# EAGLE design 6moduleboard (EAGLE 6.5.0)
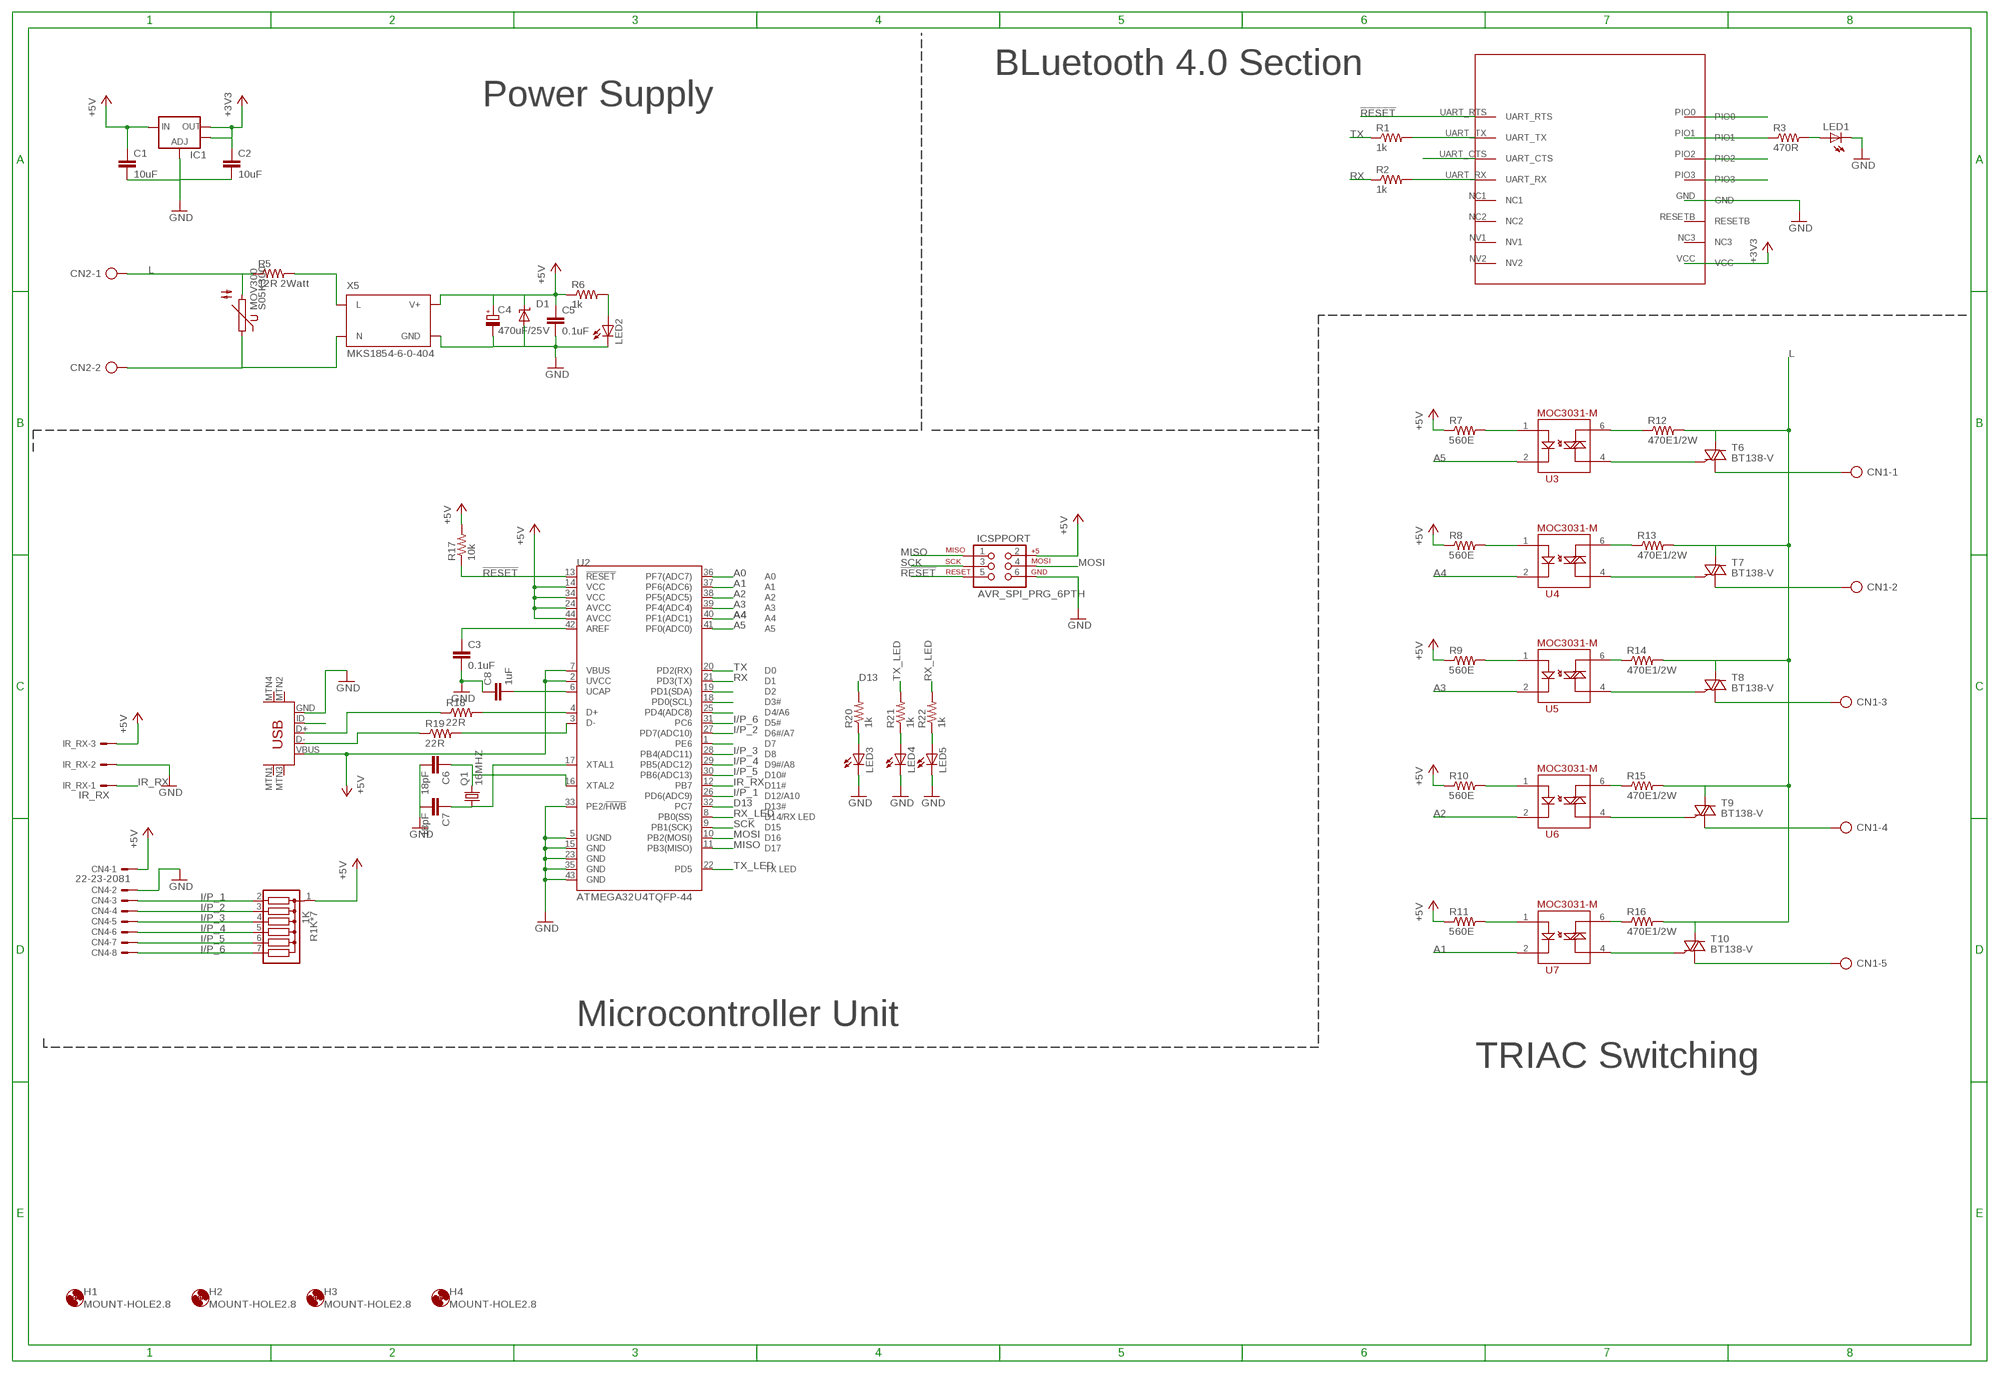
[diagram p0: schematic, sheet 1]

## Parts
C1  10uF  10UF-6.3V-20%(1206)  [1206]
C2  10uF  10UF-6.3V-20%(1206)  [1206]
C3  0.1uF  CAP1206  [1206]
C4  470uF/25V  CPOL-EUE5-8.5  [E5-8,5]
C5  0.1uF  1.0UF50V10%(1206)  [1206]
C6  18pF  CAP1206  [1206]
C7  18pF  CAP1206  [1206]
C8  1uF  CAP1206  [1206]
CN1  AK300/5  [AK300/5]
CN2  AK300/2  [AK300/2]
CN4  22-23-2081  [22-23-2081]
D1  SUPPRESSOR-SMBJ  [SMBJ]
H1  MOUNT-HOLE2.8  [2,8]
H2  MOUNT-HOLE2.8  [2,8]
H3  MOUNT-HOLE2.8  [2,8]
H4  MOUNT-HOLE2.8  [2,8]
IC1  V_REG_LM1117SOT223  [SOT223]
ICSPPORT  AVR_SPI_PRG_6PTH  [2X3]
IR_RX  IR_RX  22-23-2031  [22-23-2031]
LED1  LEDSMT1206  [1206]
LED2  LEDSMT1206  [1206]
LED3  LEDSMT1206  [1206]
LED4  LEDSMT1206  [1206]
LED5  LEDSMT1206  [1206]
MOV300  S05K300  [S05K300]
Q1  16MHZ  CRYSTALHC49UP  [HC49UP]
R1  1k  RESISTOR1206  [1206]
R1K*7  1K  G06R  [SIL7]
R2  1k  RESISTOR1206  [1206]
R3  470R  RESISTOR1206  [1206]
R5  12R 2Watt  R-US_0207/10  [0207/10]
R6  1k  RESISTOR1206  [1206]
R7  560E  RESISTOR1206  [1206]
R8  560E  RESISTOR1206  [1206]
R9  560E  RESISTOR1206  [1206]
R10  560E  RESISTOR1206  [1206]
R11  560E  RESISTOR1206  [1206]
R12  470E1/2W  R-US_0411/3V  [0411V]
R13  470E1/2W  R-US_0411/3V  [0411V]
R14  470E1/2W  R-US_0411/3V  [0411V]
R15  470E1/2W  R-US_0411/3V  [0411V]
R16  470E1/2W  R-US_0411/3V  [0411V]
R17  10k  RESISTOR1206  [1206]
R18  22R  RESISTOR1206  [1206]
R19  22R  RESISTOR1206  [1206]
R20  1k  RESISTOR1206  [1206]
R21  1k  RESISTOR1206  [1206]
R22  1k  RESISTOR1206  [1206]
T6  BT138-V  [TO220BV]
T7  BT138-V  [TO220BV]
T8  BT138-V  [TO220BV]
T9  BT138-V  [TO220BV]
T10  BT138-V  [TO220BV]
U2  ATMEGA32U4TQFP-44  [TQFP44]
U3  MOC3083  MOC3031-M  [DIL06]
U4  MOC3083  MOC3031-M  [DIL06]
U5  MOC3083  MOC3031-M  [DIL06]
U6  MOC3083  MOC3031-M  [DIL06]
U7  MOC3083  MOC3031-M  [DIL06]
U8  USB-MINIB-5PIN  [USB-MINIB]
U$1  HM-11  [HM-11]
X5  MKS1854-6-0-404  [MKS1854-6-0-404]

## Nets
!RESET: ICSPPORT.5 R17.1 U2.13(!RESET) U$1.UART_RTS
+3V3: C2.1 IC1.2(OUT) IC1.4(OUT) U$1.VCC
+5V: C1.1 C4.+ C5.1 CN4.1 D1.C IC1.3(IN) ICSPPORT.2 IR_RX.3 R1K*7.1 R6.1 R7.1 R8.1 R9.1 R10.1 R11.1 R17.2 U2.2(UVCC) U2.7(VBUS) U2.14(VCC) U2.24(AVCC) U2.34(VCC) U2.44(AVCC) U8.VBUS X5.3(V+)
A0: U2.36(PF7(ADC7))
A1: U2.37(PF6(ADC6)) U7.2
A2: U2.38(PF5(ADC5)) U6.2
A3: U2.39(PF4(ADC4)) U5.2
A4: U2.40(PF1(ADC1)) U4.2
A5: U2.41(PF0(ADC0)) U3.2
D13: R20.2 U2.32(PC7)
GND: C1.2 C2.2 C3.2 C4.- C5.2 C6.2 C7.2 C8.1 CN4.2 D1.A IC1.1(ADJ) ICSPPORT.6 IR_RX.2 LED1.C LED2.C LED3.C LED4.C LED5.C U2.5(UGND) U2.15(GND) U2.23(GND) U2.33(PE2/!HWB) U2.35(GND) U2.43(GND) U8.GND U$1.GND X5.4(GND)
I/P_1: CN4.3 R1K*7.2 U2.26(PD6(ADC9))
I/P_2: CN4.4 R1K*7.3 U2.27(PD7(ADC10))
I/P_3: CN4.5 R1K*7.4 U2.28(PB4(ADC11))
I/P_4: CN4.6 R1K*7.5 U2.29(PB5(ADC12))
I/P_5: CN4.7 R1K*7.6 U2.30(PB6(ADC13))
I/P_6: CN4.8 R1K*7.7 U2.31(PC6)
IR_RX: IR_RX.1 U2.12(PB7)
L: CN2.1 MOV300.2 R5.1 R12.2 R13.2 R14.2 R15.2 R16.2 T6.T2(A2) T7.T2(A2) T8.T2(A2) T9.T2(A2) T10.T2(A2)
MISO: ICSPPORT.1 U2.11(PB3(MISO))
MOSI: ICSPPORT.4 U2.10(PB2(MOSI))
N$1: R3.1 U$1.PIO1
N$2: LED1.A R3.2
N$3: R5.2 X5.1(L)
N$4: CN2.2 MOV300.1 X5.2(N)
N$5: R1.2 U$1.UART_TX
N$6: U$1.UART_CTS
N$7: R2.2 U$1.UART_RX
N$12: CN1.1 T6.T1(A1)
N$13: CN1.2 T7.T1(A1)
N$14: R7.2 U3.1
N$16: R12.1 U3.6
N$17: R8.2 U4.1
N$18: LED2.A R6.2
N$19: R9.2 U5.1
N$20: R10.2 U6.1
N$21: R11.2 U7.1
N$29: LED4.A R21.1
N$30: LED5.A R22.1
N$32: R13.1 U4.6
N$33: R14.1 U5.6
N$34: R15.1 U6.6
N$35: R16.1 U7.6
N$37: T6.G U3.4
N$38: U2.25(PD4(ADC8))
N$39: T7.G U4.4
N$41: T8.G U5.4
N$42: C8.2 U2.6(UCAP)
N$43: T9.G U6.4
N$44: C3.1 U2.42(AREF)
N$45: T10.G U7.4
N$46: CN1.5 T10.T1(A1)
N$47: CN1.3 T8.T1(A1)
N$48: CN1.4 T9.T1(A1)
N$49: U2.19(PD1(SDA))
N$50: R18.2 U2.4(D+)
N$51: R19.2 U2.3(D-)
N$52: R18.1 U8.D+
N$53: R19.1 U8.D-
N$54: C6.1 Q1.2 U2.16(XTAL2)
N$55: C7.1 Q1.1 U2.17(XTAL1)
N$56: U2.18(PD0(SCL))
N$72: U2.1(PE6)
N$80: LED3.A R20.1
N$81: U8.ID
RX: R2.1 U2.21(PD3(TX))
RX_LED: R22.2 U2.8(PB0(SS))
SCK: ICSPPORT.3 U2.9(PB1(SCK))
TX: R1.1 U2.20(PD2(RX))
TX_LED: R21.2 U2.22(PD5)
Unconnected: U8.MTN1(MTN2) U8.MTN2(MTN3) U8.MTN3(MTN1) U8.MTN4 U$1.NC1 U$1.NC2 U$1.NC3 U$1.NV1 U$1.NV2 U$1.PIO0 U$1.PIO2 U$1.PIO3 U$1.RESETB

## Notes on the sheet
- BLuetooth 4.0 Section
- Power Supply
- Microcontroller Unit
- TRIAC Switching

## Library data of the parts
C1 C2 = SparkFun-Capacitors:10UF-6.3V-20%(1206): CAP-10057 Ceramic; PROD_ID: CAP-10057
C3 C6-C8 = SparkFun-Passives:CAP: Capacitor Standard 0603 ceramic capacitor, and 0.1" leaded capacitor.
C4 = rcl:CPOL-EU: POLARIZED CAPACITOR, European symbol
C5 = SparkFun-Capacitors:1.0UF50V10%(1206): CAP-09822; PROD_ID: CAP-09822; VALUE: 1.0uF
CN1 = con-ptr500:AK300/5: CONNECTOR; OC_FARNELL: unknown; OC_NEWARK: unknown
CN2 = con-ptr500:AK300/2: CONNECTOR; OC_FARNELL: unknown; OC_NEWARK: unknown
CN4 = con-molex:22-23-2081: .100" (2.54mm) Center Header - 8 Pin; MF: MOLEX; MPN: 22-23-2081; OC_FARNELL: 1756826; OC_NEWARK: 01C7592
D1 = diode:SUPPRESSOR-: Suppressor diode
H1-H4 = holes:MOUNT-HOLE: MOUNTING HOLE with drill center marker
IC1 = SparkFun-PowerIC:V_REG_LM1117: Voltage Regulator LM1117 Standard adjustable voltage regulator but in SMD form. Spark Fun Electronics SKU : COM-00595; PROD_ID: VREG-08170
ICSPPORT = SparkFun-Connectors:AVR_SPI_PRG_6: AVR ISP 6 Pin This is the reduced ISP connector for AVR programming. Common on Arduino. This footprint will take up less PCB space and can be used with a 10-pin to 6-pin adapter such as SKU: BOB-08508 **Special note about "TEST_POINT" package. The stop mask is on the top side, so if you want your programming test points to be on the bottom of your board, make sure to place this package on the bottom side of the board. This also ensure that the orientation to program from the bottom side will be correct.
IR_RX = con-molex:22-23-2031: .100" (2.54mm) Center Header - 3 Pin; MF: MOLEX; MPN: 22-23-2031; OC_FARNELL: 1462950; OC_NEWARK: 30C0862
LED1-LED5 = led:LED: LED OSRAM: - CHIPLED LG R971, LG N971, LY N971, LG Q971, LY Q971, LO R971, LY R971 LH N974, LH R974 LS Q976, LO Q976, LY Q976 LO Q996 - Hyper CHIPLED LW Q18S LB Q993, LB Q99A, LB R99A - SideLED LS A670, LO A670, LY A670, LG A670, LP A670 LB A673, LV A673, LT A673, LW A673 LH A674 LY A675 LS A676, LA A676, LO A676, LY A676, LW A676 LS A679, LY A679, LG A679 - Hyper Micro SIDELED® LS Y876, LA Y876, LO Y876, LY Y876 LT Y87S - SmartLED LW L88C, LW L88S LB L89C, LB L89S, LG L890 LS L89K, LO L89K, LY L89K LS L896, LA L896, LO L896, LY L896 - TOPLED LS T670, LO T670, LY T670, LG T670, LP T670 LSG T670, LSP T670, LSY T670, LOP T670, LYG T670 LG T671, LOG T671, LSG T671 LB T673, LV T673, LT T673, LW T673 LH T674 LS T676, LA T676, LO T676, LY T676, LB T676, LH T676, LSB T676, LW T676 LB T67C, LV T67C, LT T67C, LS T67K, LO T67K, LY T67K, LW E67C LS E67B, LA E67B, LO E67B, LY E67B, LB E67C, LV E67C, LT E67C LW T67C LS T679, LY T679, LG T679 LS T770, LO T770, LY T770, LG T770, LP T770 LB T773, LV T773, LT T773, LW T773 LH T774 LS E675, LA E675, LY E675, LS T675 LS T776, LA T776, LO T776, LY T776, LB T776 LHGB T686 LT T68C, LB T68C - Hyper Mini TOPLED® LB M676 - Mini TOPLED Santana® LG M470 LS M47K, LO M47K, LY M47K Source: http://www.osram.convergy.de LUXEON: - LUMILED® LXK2-PW12-R00, LXK2-PW12-S00, LXK2-PW14-U00, LXK2-PW14-V00 LXK2-PM12-R00, LXK2-PM12-S00, LXK2-PM14-U00 LXK2-PE12-Q00, LXK2-PE12-R00, LXK2-PE12-S00, LXK2-PE14-T00, LXK2-PE14-U00 LXK2-PB12-K00, LXK2-PB12-L00, LXK2-PB12-M00, LXK2-PB14-N00, LXK2-PB14-P00, LXK2-PB14-Q00 LXK2-PR12-L00, LXK2-PR12-M00, LXK2-PR14-Q00, LXK2-PR14-R00 LXK2-PD12-Q00, LXK2-PD12-R00, LXK2-PD12-S00 LXK2-PH12-R00, LXK2-PH12-S00 LXK2-PL12-P00, LXK2-PL12-Q00, LXK2-PL12-R00 Source: www.luxeon.com KINGBRIGHT: KA-3528ASYC Source: www.kingbright.com
MOV300 = varistor:S05K300: VARISTOR
Q1 = crystal:CRYSTAL: CRYSTAL; OC_FARNELL: unknown; OC_NEWARK: unknown
R1-R3 R6 R17-R22 = SparkFun-Passives:RESISTOR: Resistor Basic schematic elements and footprints for 0603, 1206, and PTH resistors.
R1K*7 = resistor-sil:G06R: SIL RESISTOR; OC_FARNELL: unknown; OC_NEWARK: unknown
R5 R12-R16 = rcl:R-US_: RESISTOR, American symbol
R7-R11 = SparkFun-Resistors:RESISTOR: Resistor Basic schematic elements and footprints for 0603, 1206, and PTH resistors.
T6-T10 = triac:BT138: TRIAC Source: http://www.semiconductors.philips.com BT138_SERIES_2.pdf
U2 = SparkFun-DigitalIC:ATMEGA32U4: Atmel 44-pin 8-bit Microcontroller with 32KBytes of ISP Flash and USB Controller
U3-U7 = SparkFun-DiscreteSemi:MOC3031-M: Opto-isolated TRIAC
U8 = SparkFun-Connectors:USB-MINIB: Mini-USB "B" connector with 5th pin broken out. Created new symbol breaking out 5th "ID" pin in mini/micro USB connector spec. See: http://en.wikipedia.org/wiki/Mini_usb#Cables. Uses same footprint as 4-pin symbol. Also added pins to connect to mounting / shield pads if required (probably not generally needed as signals aren't shielded once they leave the connector).
U$1 = HM-11:HM-11
X5 = Morsun-con-stocko:MKS1854-6-0-404: Serie MKS 1850 Lötstifte In-line, Raster 2.5 mm, Stiftwannen, stehend, mit Rastlasche Source: http://www.stocko.de/de/index.php?seite=ka_rfk2_mks1850.html&rubrik=Katalog+-+RFK+2 rfk_1850.pdf; OC_FARNELL: 1141862; OC_NEWARK: unknown

## Board
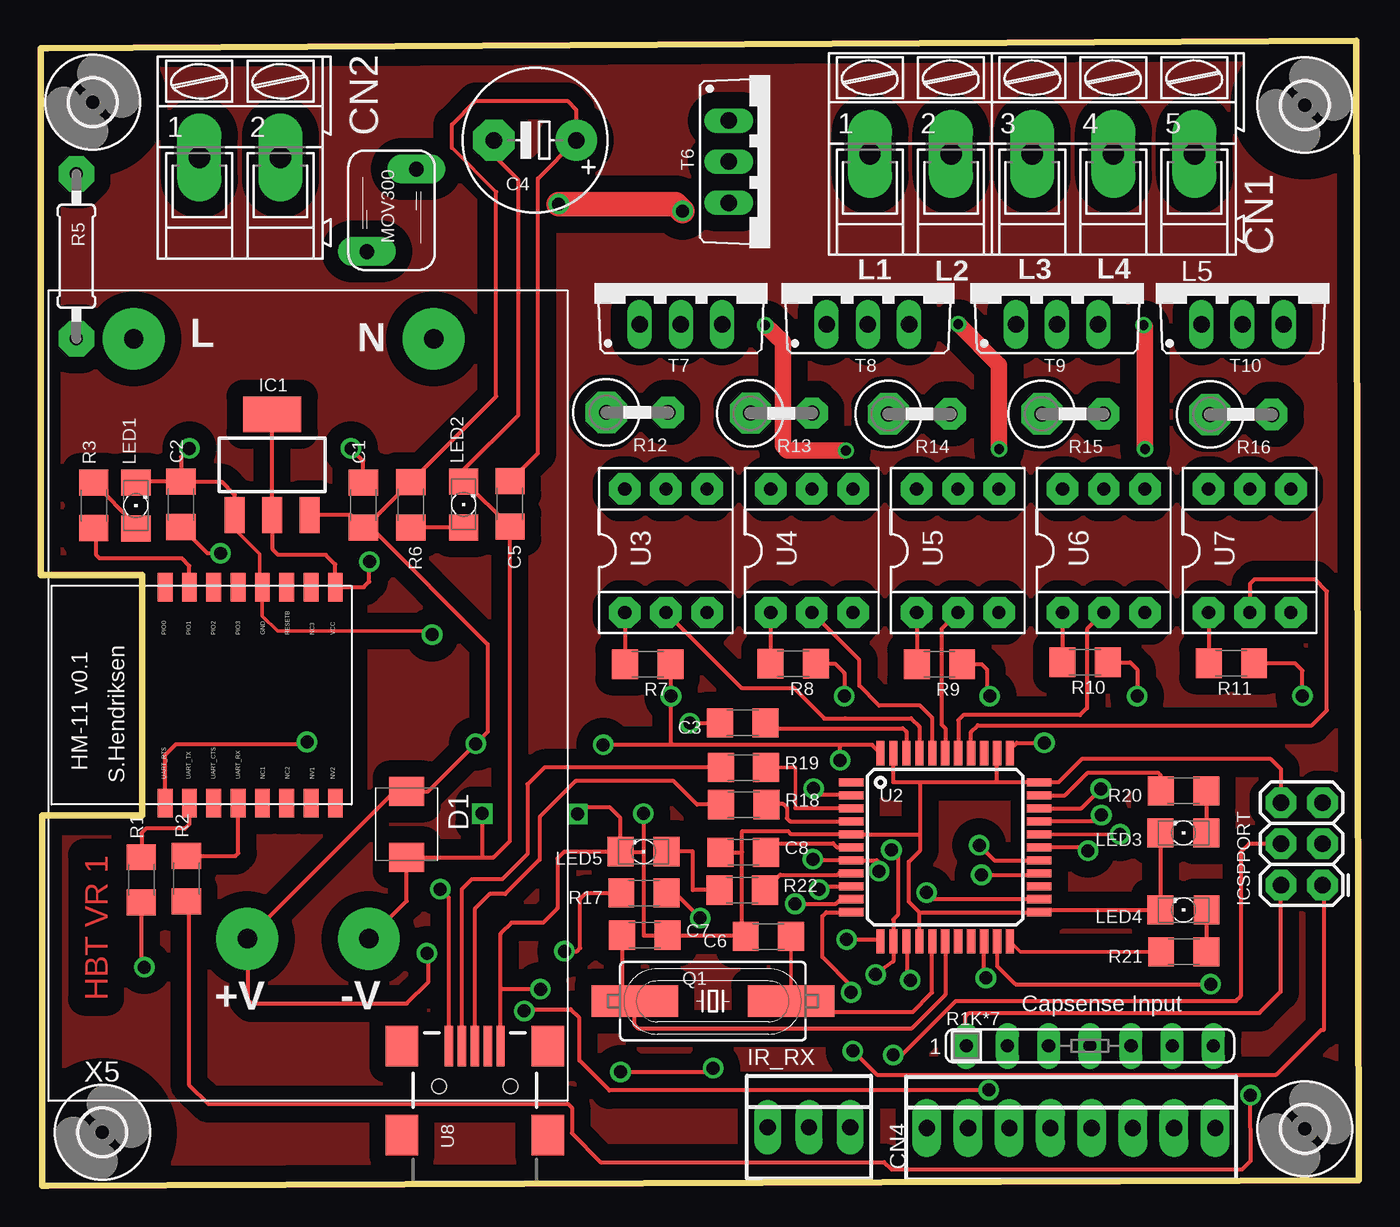
[diagram p1: board, top side]
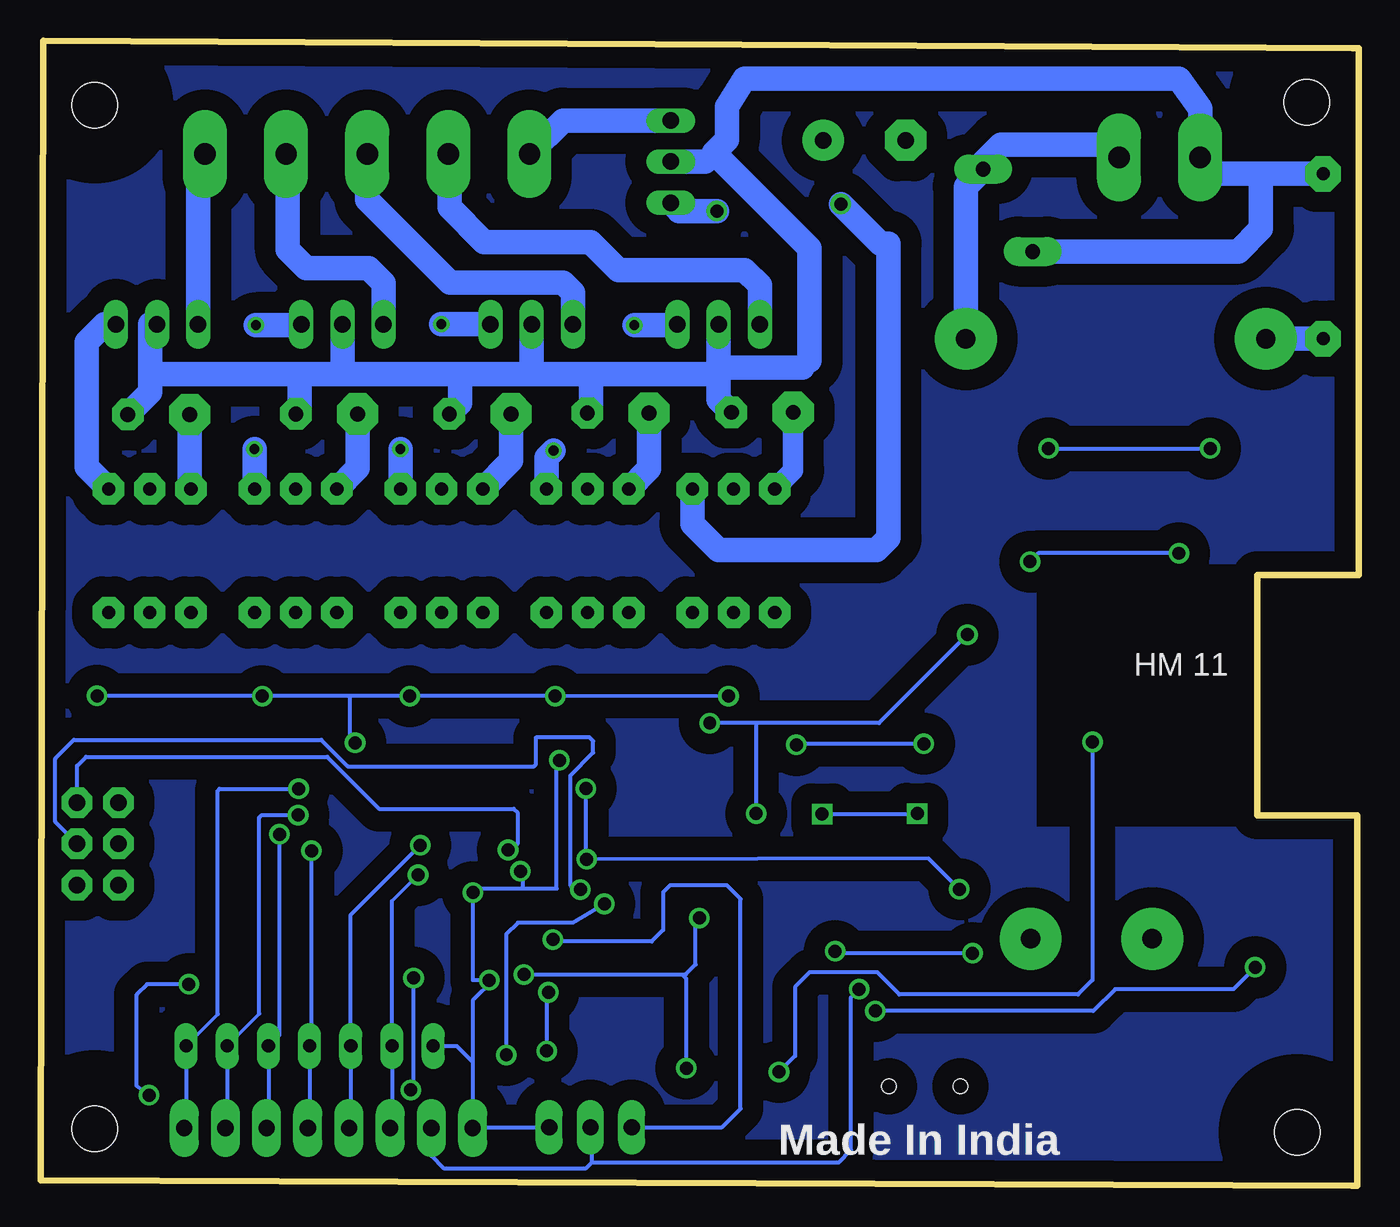
[diagram p2: board, bottom side, seen from below]

Size 81.3 x 70.64 mm. Coordinates in mm from the lower left corner, seen from the top.
Outline: 0.3,70.16 81.12,70.64 81.3,0.35 0.43,0 0.1,0 0.1,22.86 6.27,22.86 6.27,37.67 0,37.67 0,70.15 0.41,70.15
Copper layers (1*16): Top 0.035mm / dielectric 1.5mm / Bottom 0.035mm
Design rules "default": minimum track width 10mil, minimum drill 24mil, track to track 8mil, track to pad 8mil, pad to pad 8mil, via to via 8mil, smd to smd 8mil, copper to edge 40mil, drill to drill 8mil, minimum pad ring 10mil, minimum via ring 8mil, stop-mask expansion 4mil, vias tented up to drill 0mil, thermal gap 10mil

### Footprints (pad centres in the part's own frame; a part is rotated, then mirrored left to right if it is on the bottom)
1206 = smd 1.6 x 1.8: 1 -1.4,0; 2 1.4,0
E5-8,5 = drill 1.016 pad 2.54: + -2.54,0 | drill 1.016 pad 2.54 octagon: - 2.54,0
AK300/5 = drill 1.321 pad 2.7 long: 1 -10.008,0; 2 -5.004,0; 3 0,0; 4 5.004,0; 5 10.008,0
AK300/2 = drill 1.321 pad 2.7 long: 1 -2.515,0; 2 2.489,0
22-23-2081 = drill 1 pad 1.778 long: 1 -8.89,0; 2 -6.35,0; 3 -3.81,0; 4 -1.27,0; 5 1.27,0; 6 3.81,0; 7 6.35,0; 8 8.89,0
SMBJ = smd 1.78 x 2.16: A 2.04,0; C -2.03,0
2,8 = hole 2.8: 0,0
SOT223 = smd 1.219 x 2.235: 1 -2.311,-3.099; 2 0,-3.099; 3 2.311,-3.099 | smd 3.6 x 2.2: 4 0,3.099
2X3 = drill 1.016 pad 1.88 octagon: 1 0,0; 2 0,2.54; 3 2.54,0; 4 2.54,2.54; 5 5.08,0; 6 5.08,2.54
22-23-2031 = drill 1 pad 1.676 long: 1 -2.54,0; 2 0,0; 3 2.54,0
1206' = smd 1.6 x 1.803: A -1.422,0; C 1.422,0
S05K300 = drill 0.914 pad 1.778 long: 1 -1.524,-2.54; 2 1.524,2.54
HC49UP = smd 5.334 x 1.93: 1 -4.826,0; 2 4.826,0
SIL7 = drill 0.813 pad 1.422 long: 1 -7.62,0; 2 -5.08,0; 3 -2.54,0; 4 0,0; 5 2.54,0; 6 5.08,0; 7 7.62,0
0207/10 = drill 0.8 pad 2.184 octagon: 1 -5.08,0; 2 5.08,0
0411V = drill 0.914 pad 2.54 octagon: 1 -2.54,0 | drill 0.914 pad 1.93 octagon: 2 1.27,0
TO220BV = drill 1.016 long: G 2.54,-2.54; T1 -2.54,-2.54; T2 0,-2.54
TQFP44 = smd 1.5 x 0.5: 1 -5.8,4; 2 -5.8,3.2; 3 -5.8,2.4; 4 -5.8,1.6; 5 -5.8,0.8; 6 -5.8,0; 7 -5.8,-0.8; 8 -5.8,-1.6; 9 -5.8,-2.4; 10 -5.8,-3.2; 11 -5.8,-4; 23 5.8,-4; 24 5.8,-3.2; 25 5.8,-2.4; 26 5.8,-1.6; 27 5.8,-0.8; 28 5.8,0; 29 5.8,0.8; 30 5.8,1.6; 31 5.8,2.4; 32 5.8,3.2; 33 5.8,4 | smd 0.5 x 1.5: 12 -4,-5.8; 13 -3.2,-5.8; 14 -2.4,-5.8; 15 -1.6,-5.8; 16 -0.8,-5.8; 17 0,-5.8; 18 0.8,-5.8; 19 1.6,-5.8; 20 2.4,-5.8; 21 3.2,-5.8; 22 4,-5.8; 34 4,5.8; 35 3.2,5.8; 36 2.4,5.8; 37 1.6,5.8; 38 0.8,5.8; 39 0,5.8; 40 -0.8,5.8; 41 -1.6,5.8; 42 -2.4,5.8; 43 -3.2,5.8; 44 -4,5.8
DIL06 = drill 0.813 pad 1.93 octagon: 1 -3.51,-3.81; 2 -0.97,-3.81; 3 1.57,-3.81; 4 1.57,3.81; 5 -0.97,3.81; 6 -3.51,3.81
USB-MINIB = smd 2.5 x 0.5: D+ 2.5,0; D- 2.5,0.8; GND 2.5,-1.6; ID 2.5,-0.8; VBUS 2.5,1.6 | smd 2.5 x 2: MTN1 -3,4.5; MTN2 2.5,4.5; MTN3 -3,-4.5; MTN4 2.5,-4.5 | hole 0.9: 0,2.2; 0,-2.2
HM-11 = smd 1.778 x 0.914: GND 7.508,-0.6; NC1 -5.808,-0.6; NC2 -5.808,-2.1; NC3 7.508,-3.6; NV1 -5.808,-3.6; NV2 -5.808,-5.1; PIO0 7.508,5.4; PIO1 7.508,3.9; PIO2 7.508,2.4; PIO3 7.508,0.9; RESETB 7.508,-2.1; UART_CTS -5.808,2.4; UART_RTS -5.808,5.4; UART_RX -5.808,0.9; UART_TX -5.808,3.9; VCC 7.508,-5.1
MKS1854-6-0-404 = drill 1.2 pad 3.81: 1 5.25,47; 2 23.75,47; 3 12.25,10; 4 19.75,10

### Placement (x,y rotation side)
C1  19.9,41.99 90 top
C2  8.66,42.04 90 top
C3  43.31,28.56 180 top
C4  30.49,64.49 180 top
C5  28.95,42.07 270 top
C6  44.88,15.39 180 top
C7  37.26,15.47 0 top
C8  43.34,20.58 0 top
CN1  61.15,63.64 0 top
CN2  12.31,63.42 0 top
CN4  63.55,3.57 0 top
D1  22.57,22.3 270 top
H1  3.22,66.84 0 top
H2  77.96,66.66 0 top
H3  3.81,3.31 0 top
H4  77.97,3.53 0 top
IC1  14.28,44.48 0 top
ICSPPORT  79.04,18.56 90 top
IR_RX  47.39,3.62 0 top
LED1  [1206']  5.88,41.96 90 top
LED2  [1206']  26.09,42.03 90 top
LED3  [1206']  70.48,21.77 180 top
LED4  [1206']  70.48,17.02 180 top
LED5  [1206']  37.18,20.62 180 top
MOV300  21.65,60.17 180 top
Q1  41.46,11.4 0 top
R1  6.21,18.88 90 top
R1K*7  64.71,8.64 0 top
R2  9,18.95 90 top
R3  3.28,41.97 90 top
R5  2.21,57.33 270 top
R6  22.83,42.01 270 top
R7  37.44,32.18 180 top
R8  46.42,32.21 180 top
R9  55.43,32.18 180 top
R10  64.41,32.3 180 top
R11  73.43,32.23 180 top
R12  37.43,47.71 0 top
R13  46.31,47.66 0 top
R14  54.82,47.61 0 top
R15  64.28,47.61 0 top
R16  74.65,47.58 0 top
R17  37.21,18.07 180 top
R18  43.37,23.52 0 top
R19  43.35,25.81 0 top
R20  70.48,24.37 180 top
R21  70.5,14.44 180 top
R22  43.26,18.25 0 top
T6  44.98,63.17 270 top
T7  39.49,55.68 0 top
T8  51.02,55.68 0 top
T9  62.69,55.68 0 top
T10  74.12,55.68 0 top
U2  55.79,20.89 0 top
U3  39.53,39.18 0 top
U4  48.53,39.18 0 top
U5  57.53,39.18 0 top
U6  66.53,39.18 0 top
U7  75.53,39.18 0 top
U8  26.78,6.14 90 top
U$1  13.08,29.42 90 top
X5  0.49,5.24 0 top

### Tracks (layer width: path | path; a pad name or v marks a point on that pad's centre or on a via)
!RESET  (via drill 0.8 pad 1.27)
  Top 0.254: v51.49,13.04 52.59,13.85 U2.13 52.59,16.43 52.86,16.71 52.86,20.33 v52.47,20.72 | U$1.UART_RTS 7.68,26.57 8.36,27.25 16.31,27.25 v16.43,27.38 | v35.76,7.04 41.25,7.04 v41.48,7.26 | R17.1 39.13,18.07 v40.67,16.53
  Bottom 0.254: v51.49,13.04 41.73,13.04 | 41.73,13.04 41.53,13.04 40.9,13.67 40.9,16.51 40.88,16.53 v40.67,16.53 | ICSPPORT.5 79.04,25.91 78.49,26.47 63.63,26.47 60.43,23.27 52.12,23.27 51.89,23.04 51.89,21.11 52.28,20.72 v52.47,20.72 | v16.43,27.38 16.43,12.7 17.32,11.81 28.34,11.81 29.72,13.19 33.85,13.19 34.77,12.27 34.77,8.03 v35.76,7.04 | v41.48,7.26 41.48,12.78 41.73,13.04
+3V3  (via drill 0.8 pad 1.27)
  Top 0.203: 14.31,41.35 IC1.2
  Top 0.254: IC1.2 IC1.4 | 14.31,41.35 14.31,39.25 14.66,38.91 17.59,38.91 18.18,38.32 U$1.VCC 19.93,36.93 20.27,37.26 20.27,38.48 v20.28,38.5 | C2.1 10.28,39.02 v11.1,39.02
  Bottom 0.254: v11.1,39.02 19.76,39.02 v20.28,38.5
+5V  (via drill 0.8 pad 1.27)
  Top 0.203: IC1.3 16.11,40.59 | 19.11,41.38 C1.1 20.01,40.59 20.38,40.59 | 21.83,24.33 D1.C | 38.84,30.49 38.88,30.45 | R11.1 | 58.37,30.37 v58.53,30.2 | 28.11,61.3 25.38,64.03 | 38.99,27.2 38.88,27.31 | U2.24 61.59,17.72 | 53.43,15.09 U2.14 | U2.34 59.79,26.91 | v34.69,27.2 34.62,27.2 | 49.31,27.09 49.42,27.2 | ICSPPORT.2 76.46,18.52 | 57.03,8.7 R1K*7.1
  Top 0.254: 20.01,40.59 R6.1 28.11,48.69 28.11,61.3 | 19.11,41.38 IC1.3 | 21.83,24.33 X5.3 12.77,15.22 12.77,11.49 13,11.25 22.58,11.25 23.93,12.6 23.93,14.25 v23.83,14.35 | R7.1 38.84,30.49 | 38.88,30.45 v38.88,30.2 38.88,27.31 | v77.81,30.22 77.81,31.78 77.36,32.23 R11.1 | R8.1 48.98,32.21 49.57,31.62 v49.57,30.2 | R9.1 58.03,32.18 58.37,31.84 58.37,30.37 | R10.1 67.19,32.3 67.63,31.86 v67.63,30.2 | C5.1 30.67,45.19 30.67,62.13 C4.+ 33.03,66.37 32.49,66.91 26.83,66.91 25.38,65.46 25.38,64.03 | U2.44 51.27,27.2 49.42,27.2 38.99,27.2 v34.69,27.2 | D1.C 23.89,24.33 v26.83,27.27 27.57,28.01 27.57,33.4 20.38,40.59 | v49.31,26.25 49.31,27.09 | 76.46,18.52 76.46,11.96 75.17,10.67 57.26,10.67 57.03,10.43 57.03,8.7 | R17.2 33.64,18.07 33.27,17.7 33.27,14.68 33.07,14.48 v32.31,14.48 | 59.79,26.91 60.2,27.33 v61.9,27.33 | 53.43,15.09 53.43,12.69 v53.63,12.69 | v47.62,20.15 47.83,20.09 U2.7 51.57,20.09 51.7,19.97 51.7,19.42 v51.71,19.41 | U8.VBUS 25.18,17.77 v24.65,18.3 | U2.2 49.97,24.1 47.88,24.1 47.68,24.31 v47.68,24.51 | U2.24 54.63,17.69 v54.63,18.1
  Bottom 0.203: CN4.1 | v38.88,30.2 v49.57,30.2 | 77.8,30.2 v77.81,30.22 | 34.62,27.27 v34.69,27.2 | 49.47,26.08 v49.31,26.25
  Bottom 0.254: R1K*7.1 55.63,8.64 54.66,7.66 | 54.66,7.66 CN4.1 | CN4.1 54.61,3.62 IR_RX.3 | v49.57,30.2 v58.53,30.2 62.2,30.2 | 62.2,30.2 v67.63,30.2 77.8,30.2 | 54.66,7.66 54.66,11.44 53.4,12.69 v53.63,12.69 54.63,12.69 v54.63,18.1 54.63,18.33 51.58,18.33 | v26.83,27.27 34.62,27.27 | 49.47,26.08 49.47,18.33 51.58,18.33 | v23.83,14.35 32.18,14.35 v32.31,14.48 | v61.9,27.33 62.2,27.63 62.2,30.2 | v24.65,18.3 26.54,20.19 v47.62,20.15 47.68,20.16 v47.68,24.51 | 51.58,18.33 51.55,18.36 51.55,19.25 v51.71,19.41
A1
  Top 0.254: U2.37 57.39,28 57.79,28.4 78.4,28.4 79.33,29.33 79.33,36.67 78.59,37.41 74.85,37.41 74.58,37.14 74.58,35.38 U7.2
A2
  Top 0.254: U6.2 64.53,34.33 64.53,29.47 64.1,29.04 56.9,29.04 56.59,28.72 U2.38
A3
  Top 0.254: U5.2 55.56,34.36 55.56,28.46 55.79,28.23 U2.39
A4
  Top 0.254: U2.40 54.99,28.88 54.23,29.63 51.71,29.63 50.5,30.85 50.5,32.44 U4.2
A5
  Top 0.254: U3.2 43.22,30.71 46.45,30.71 48.34,28.83 49.6,28.83 49.61,28.84 53.67,28.84 54.19,28.33 U2.41
D13
  Top 0.203: 68.8,24.09 R20.2
  Top 0.254: 68.99,24.46 R20.2 69.06,24.38 69.06,25.32 68.88,25.5 64.59,25.5 63.18,24.09 U2.32
GND  (via drill 0.8 pad 1.27)
  Top 0.203: IC1.1 11.97,40.53 13.52,38.98 13.52,37.08 U$1.GND 13.68,35.16 14.62,34.22 23.92,34.22 v24.14,33.99 | 8.71,43.4 C2.2 | 5.94,43.44 LED1.C | LED4.C | U2.23 61.72,17.02 | U2.35 58.95,26.69 | 43.26,15.39 C6.2 43.48,15.47 | 41.91,28.49 C3.2 | 38.66,15.45 C7.2 | v40.03,28.54 40.05,28.56 | 26.09,44.17 LED2.C 26.16,43.45 | 28.94,40.66 C5.2
  Top 0.254: IC1.1 11.97,42.61 11.19,43.4 8.71,43.4 | 5.94,43.44 C2.2 8.66,44.96 v9.18,45.48 | C1.2 19.9,44.72 v19.14,45.48 | LED3.C LED4.C | 61.72,17.02 LED4.C | 58.95,24.89 U2.33 62.77,24.89 64.2,26.32 75.87,26.32 76.5,25.69 ICSPPORT.6 | 58.95,24.89 54.25,24.89 | 54.25,24.89 52.59,24.89 U2.43 | 58.95,26.69 58.95,24.89 | 54.19,16.89 U2.23 | U2.15 54.19,16.89 | 43.26,15.39 43.26,20.58 | 43.26,20.58 43.26,21.87 46.11,21.87 46.29,21.69 U2.5 54.25,21.69 | C8.1 43.26,20.58 | LED5.C 37.2,20.62 | 37.2,20.62 37.2,15.45 38.66,15.45 | C7.2 43.48,15.47 | U8.GND 28.38,12.24 | 28.38,12.24 28.38,15.57 29.04,16.23 30.99,16.23 31.88,17.12 31.88,20.19 32.31,20.63 LED5.C | 40.05,28.56 C3.2 | v30.82,12.13 28.49,12.13 28.38,12.24 | 54.25,21.69 54.25,24.89 | v37.17,22.96 37.2,22.96 37.2,20.62 | C5.2 26.16,43.45 | X5.4 22.57,17.57 D1.A 27.21,20.26 | 27.21,20.26 27.93,20.26 28.94,21.27 28.94,40.66 | 26.09,44.17 29.46,47.55 29.46,62.03 27.95,63.54 C4.- | LED5.C 35.76,22.69 35.12,23.33 33.5,23.33 v33.1,22.94 | v27.24,22.96 27.24,20.29 27.21,20.26 | 54.19,16.89 53.54,17.53 53.54,19.99 54.25,20.7 54.25,21.69
  Bottom 0.203: 47.33,3.62 IR_RX.2 47.31,3.54
  Bottom 0.254: 47.33,3.62 47.31,3.65 | 47.31,1.46 47.7,1.06 56.41,1.06 57.2,1.85 CN4.2 | v19.14,45.48 v9.18,45.48 | v24.14,33.99 29.6,28.54 37.17,28.54 | 47.31,1.46 32.08,1.46 31.32,2.22 31.32,11.63 v30.82,12.13 | 47.31,1.46 47.31,3.54 | 37.17,28.54 v37.17,22.96 | 37.17,28.54 v40.03,28.54 | v33.1,22.94 27.27,22.94 v27.24,22.96
I/P_1  (via drill 0.8 pad 1.27)
  Top 0.203: 61.48,19.18 U2.26
  Top 0.254: v58.02,19.18 61.48,19.18
  Bottom 0.203: 59.63,17.58 v58.02,19.18
  Bottom 0.254: CN4.3 59.63,3.68 R1K*7.2 59.63,17.58
I/P_2  (via drill 0.8 pad 1.27)
  Top 0.254: v57.88,21.01 58.81,20.09 U2.27
  Bottom 0.254: CN4.4 62.17,3.68 R1K*7.3 62.17,16.73 v57.88,21.01
I/P_3  (via drill 0.8 pad 1.27)
  Top 0.254: v64.59,20.68 64.38,20.89 U2.28
  Bottom 0.203: 64.71,3.68 CN4.5
  Bottom 0.254: 64.71,3.68 R1K*7.4 64.59,8.76 v64.59,20.68
I/P_4  (via drill 0.8 pad 1.27)
  Top 0.203: v66.57,21.69 U2.29
  Bottom 0.203: 67.25,3.68 CN4.6 | R1K*7.5 66.57,9.32
  Bottom 0.254: R1K*7.5 67.25,3.68 | 66.57,9.32 v66.57,21.69
I/P_5  (via drill 0.8 pad 1.27)
  Top 0.254: v65.42,22.88 65.03,22.49 U2.30
  Bottom 0.203: 69.79,3.68 CN4.7 | R1K*7.6 67.81,10.62
  Bottom 0.254: R1K*7.6 69.79,3.68 | 67.81,10.62 67.81,22.72 67.65,22.88 v65.42,22.88
I/P_6  (via drill 0.8 pad 1.27)
  Top 0.254: U2.31 64.18,23.29 v65.38,24.49
  Bottom 0.203: 72.33,3.68 CN4.8 | R1K*7.7 70.38,10.59
  Bottom 0.254: R1K*7.7 72.33,3.68 | 70.38,10.59 70.38,24.39 70.27,24.5 65.39,24.5 v65.38,24.49
IR_RX  (via drill 0.8 pad 1.27)
  Top 0.203: 51.67,15.2 U2.12
  Top 0.254: v49.71,15.2 51.67,15.2
  Bottom 0.254: IR_RX.1 39.27,3.62 38.13,4.77 38.13,17.69 38.98,18.54 42.48,18.54 42.91,18.11 42.91,15.79 43.62,15.08 49.59,15.08 v49.71,15.2
L
  Bottom 0.813: 39.49,50.46 39.49,50.06 | R15.2 65.32,47.84 | 40.33,63.17 40.16,63.17
  Bottom 1.27: 74.53,53.14 T10.T2 | 33.88,50.89 34.3,50.46 | 39.78,63.73 40.33,63.17
  Bottom 1.524: 6.04,62.41 8.78,62.41 CN2.1 9.79,66.43 11.1,68.29 37.88,68.29 38.98,66.57 38.98,64.53 39.78,63.73 33.88,57.83 33.88,50.89 | 6.04,62.41 R5.1 | T7.T2 39.49,50.46 34.3,50.46 | 47.34,50.06 39.49,50.06 39.49,48.5 R12.2 | 47.34,50.06 51.02,50.06 | 51.02,50.06 55.41,50.06 | 55.41,50.06 62.69,50.06 | 62.69,50.06 65.32,50.06 | 65.32,50.06 74.53,50.06 | 74.53,50.06 74.53,53.14 | T8.T2 51.02,50.06 | T9.T2 62.69,50.06 | R16.2 74.53,48.97 74.53,50.06 | 65.32,47.84 65.32,50.06 | R14.2 55.41,48.29 55.41,50.06 | R13.2 47.34,47.89 47.34,50.06 | T6.T2 40.33,63.17 | MOV300.2 7.45,57.63 6.04,59.04 6.04,62.41
MISO  (via drill 0.8 pad 1.27)
  Top 0.254: ICSPPORT.1 79.12,18.48 79.12,9.63 78.97,9.63 76.2,6.86 51.56,6.86 v50.09,8.33 | U2.11 48.46,16.89 48.21,16.64 48.21,14.12 49.99,12.34 v49.99,11.94
  Bottom 0.254: v49.99,11.94 50.09,11.84 v50.09,8.33
MOSI  (via drill 0.8 pad 1.27)
  Top 0.254: ICSPPORT.4 74.52,21.1 74.01,20.59 74.01,11.7 73.71,11.4 56.44,11.4 53.11,8.08 v52.58,8.08 | U2.10 49.97,17.7 49.35,17.7 49.05,17.4 v46.53,17.4
  Bottom 0.254: v46.53,17.4 48.49,16.23 51.87,16.23 52.58,15.52 v52.58,8.08
N$1
  Top 0.203: 3.45,40.4 R3.1
  Top 0.254: U$1.PIO1 9.18,38.25 8.72,38.7 3.65,38.7 3.45,38.9 3.45,40.4
N$2
  Top 0.203: LED1.A 5.88,40.77
  Top 0.254: 5.88,40.77 R3.2
N$3
  Bottom 0.203: R5.2
  Bottom 1.524: X5.1 R5.2
N$4
  Bottom 1.524: CN2.2 15.59,64.22 22.09,64.22 23.17,63.13 MOV300.1 24.24,61.63 X5.2
N$5
  Top 0.254: U$1.UART_TX 9.18,22.31 8.92,22.05 6.5,22.05 6.22,21.77 R1.2
N$7
  Top 0.254: R2.2 12.01,20.34 12.19,20.52 12.19,23.59 U$1.UART_RX
N$8
  pour Top (isolate 1.016): 0.56,70.03 0.56,38.1 20.27,38.1 20.27,21.82 0.38,21.82 0.38,0.36 81.28,0.36 81.28,70.05 0.56,70.05
N$9
  pour Bottom (isolate 1.27): 0.53,38.46 20.02,38.46 20.02,22.05 0.48,22.05 0.48,0.13 81.13,0.13 81.13,70.56 0.46,70.56 0.46,38.46
N$12
  Bottom 1.524: CN1.1 49.08,65.71 T6.T1
N$13
  Bottom 1.524: T7.T1 36.95,55.54 37.9,56.49 45.67,56.49 47.4,58.22 53.95,58.22 56.08,60.35 56.08,63.58 CN1.2
N$14
  Top 0.203: U3.1 36.04,35.36
  Top 0.254: 36.04,35.36 R7.2
N$16
  Bottom 1.27: U3.6 34.89,44.12 R12.1
N$17
  Top 0.203: U4.1
  Top 0.254: U4.1 R8.2
N$18
  Top 0.203: LED2.A
  Top 0.254: LED2.A R6.2
N$19
  Top 0.203: U5.1
  Top 0.254: U5.1 R9.2
N$20
  Top 0.203: U6.1
  Top 0.254: U6.1 R10.2
N$21
  Top 0.203: U7.1
  Top 0.254: U7.1 R11.2
N$29
  Top 0.203: R21.1
  Top 0.254: LED4.A R21.1
N$30
  Top 0.203: LED5.A
  Top 0.254: R22.1 40.23,18.25 40.23,20.62 LED5.A
N$32
  Bottom 1.524: U4.6 43.77,44.24 R13.1
N$33
  Bottom 1.524: U5.6 52.28,44.73 R14.1
N$34
  Bottom 1.524: U6.6 61.74,44.27 R15.1
N$35
  Bottom 0.813: U7.6 72.11,43.07
  Bottom 1.524: 72.11,43.07 R16.1
N$37  (via drill 0.8 pad 1.27)
  Top 1.524: v31.95,60.55 39.17,60.55 v39.6,60.12
  Bottom 1.524: U3.4 41.1,40.82 39.5,39.22 29.74,39.22 29.01,39.95 29.01,58.11 29.51,58.11 v31.95,60.55 | v39.6,60.12 41.93,60.12 T6.G
N$39  (via drill 0.6)
  Top 1.016: v44.69,53.08 45.78,52.04 45.78,45.67 46.05,45.35 v49.66,45.35
  Bottom 0.813: T7.G 42.09,53.08
  Bottom 1.524: 42.09,53.08 v44.69,53.08 | v49.66,45.35 50.1,44.91 U4.4
N$41  (via drill 0.6)
  Top 1.016: v56.59,53.15 59.1,50.63 v59.1,45.44
  Bottom 0.305: v59.1,45.44
  Bottom 0.813: T8.G 53.57,53.15
  Bottom 1.524: 53.57,53.15 v56.59,53.15 | v59.1,45.44 U5.4
N$42
  Top 0.203: 44.74,20.89 C8.2
  Top 0.254: 44.74,20.89 44.99,21.13 48.87,21.13 49.12,20.89 U2.6
N$43  (via drill 0.6)
  Top 0.305: v68.03,53.08 68.1,53.01
  Top 1.016: 68.1,53.01 v68.1,45.45
  Bottom 0.305: v68.1,45.45
  Bottom 0.813: T9.G 65.28,53.08
  Bottom 1.524: 65.28,53.08 v68.03,53.08 | v68.1,45.45 U6.4
N$44
  Top 0.203: C3.1 45.04,28.22
  Top 0.254: 45.04,28.22 53.18,28.22 53.39,28.01 U2.42
N$45
  Bottom 1.524: U7.4 78.44,44.33 78.44,52.04 77.35,53.14 T10.G
N$46
  Bottom 1.27: CN1.5 71.58,63.22
  Bottom 1.524: 71.58,63.22 T10.T1
N$47
  Bottom 1.524: T8.T1 48.48,55.1 49.08,55.7 56.04,55.7 61.15,60.82 CN1.3
N$48
  Bottom 1.016: 66.06,63.55 CN1.4
  Bottom 1.524: T9.T1 60.15,55.68 61.07,56.61 64.92,56.61 66.06,57.75 66.06,63.55
N$50
  Top 0.203: 44.77,23.56 R18.2
  Top 0.254: 44.77,23.56 45.81,23.56 46.02,23.34 46.02,22.68 46.22,22.49 U2.4
N$51
  Top 0.203: 46.54,23.29 46.54,25.81 R19.2
  Top 0.254: U2.3 46.54,23.29
N$52
  Top 0.254: U8.D+ 26.77,8.65 26.77,17.07 27.7,18 28.65,18 30.77,20.13 30.77,22.75 32.99,24.97 39.04,24.97 40.49,23.52 R18.1
N$53
  Top 0.254: R19.1 31.07,25.81 30.03,24.77 30.03,20.47 28.47,18.91 26.58,18.91 25.97,18.3 25.97,8.65 U8.D-
N$54
  Top 0.203: C6.1 Q1.2 46.31,11.38
  Top 0.254: Q1.2 46.29,10.99 46.56,10.72 53.77,10.72 54.98,11.93 U2.16
N$55
  Top 0.203: 35.86,11.4 Q1.1
  Top 0.254: C7.1 35.86,11.4 | U2.17 55.79,11.79 53.7,9.7 36.89,9.7 36.64,9.95 Q1.1
N$80
  Top 0.203: 71.88,21.79 LED3.A
  Top 0.254: R20.1 71.88,21.79
RX  (via drill 0.8 pad 1.27)
  Top 0.254: U2.21 58.98,13.59 60.12,12.45 v72.16,12.45 | R2.1 9.14,17.4 9.14,6.25 10.34,5.05 32.54,5.05 32.77,4.83 32.77,3.25 34.54,1.47 52.02,1.47 52.48,1.02 74.09,1.02 74.63,1.55 v74.61,5.6
  Bottom 0.254: v74.61,5.6 75.36,6.15 75.36,11.81 74.73,12.45 v72.16,12.45
RX_LED
  Top 0.203: 44.66,18.26 R22.2
  Top 0.254: 44.66,18.26 45.6,19.19 49.15,19.19 49.24,19.29 U2.8
SCK  (via drill 0.8 pad 1.27)
  Top 0.254: v48.01,18.28 48.01,18.49 U2.9
  Bottom 0.254: ICSPPORT.3 80.39,22.45 80.39,26.36 79.25,27.51 63.98,27.51 62.36,25.88 50.88,25.88 50.75,26.01 50.75,27.63 50.7,27.69 47.47,27.69 47.22,27.43 47.22,26.72 48.64,25.3 48.64,18.54 v48.01,18.28
TX  (via drill 0.8 pad 1.27)
  Top 0.254: R1.1 6.21,13.67 v6.4,13.49 | v29.82,10.79 29.92,10.9 32.69,10.9 33.22,10.36 33.22,7.75 35.08,5.89 58.32,5.89 v58.47,5.92 | v58.29,12.83 58.19,12.93 U2.20
  Bottom 0.254: v6.4,13.49 7.75,12.14 15.04,12.14 16.38,10.79 v29.82,10.79 | v58.47,5.92 58.29,6.07 v58.29,12.83
TX_LED
  Top 0.203: U2.22 60.43,14.44 R21.2

### Text on the board
Top: HBT VR 1
tPlace: L1 | L2 | L3 | L4 | L5 | L | N | V+ | V- | Capsense Input
bPlace: HM 11 | Made In India